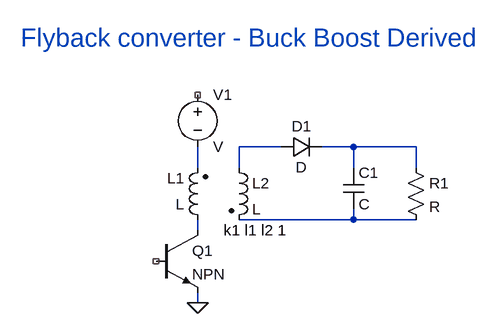
[diagram p0: schematic Flyback converter - Buck Boost Derived.asc]
Flyback converter - Buck Boost Derived.asc, the LTspice schematic file:
Version 4
SHEET 1 956 680
WIRE 288 128 224 128
WIRE 400 128 352 128
WIRE 496 128 400 128
WIRE 160 160 160 128
WIRE 224 160 224 128
WIRE 400 160 400 128
WIRE 496 160 496 128
WIRE 400 240 400 224
WIRE 400 240 224 240
WIRE 496 240 400 240
WIRE 160 256 160 240
WIRE 160 368 160 352
FLAG 160 368 0
SYMBOL voltage 160 32 R0
SYMATTR InstName V1
SYMBOL npn 96 256 R0
SYMATTR InstName Q1
SYMBOL ind2 176 256 R180
WINDOW 0 36 80 Left 2
WINDOW 3 36 40 Left 2
SYMATTR InstName L1
SYMBOL ind2 208 144 R0
SYMATTR InstName L2
SYMBOL diode 288 144 R270
WINDOW 0 32 32 VTop 2
WINDOW 3 0 32 VBottom 2
SYMATTR InstName D1
SYMBOL cap 384 160 R0
SYMATTR InstName C1
SYMBOL res 480 144 R0
SYMATTR InstName R1
TEXT 200 256 Left 2 !k1 l1 l2 1
TEXT -112 -40 Left 4 ;Flyback converter - Buck Boost Derived

The netlist it stands for:
* Flyback converter - Buck Boost Derived.asc
V1 NC_01 N003 V
Q1 N005 NC_02 0 0 NPN
L1 N005 N003 L
L2 N001 N004 L
D1 N001 N002 D
C1 N002 N004 C
R1 N002 N004 R
.model D D
.lib standard.dio
.model NPN NPN
.model PNP PNP
.lib standard.bjt
k1 l1 l2 1
* Flyback converter - Buck Boost Derived
.backanno
.end